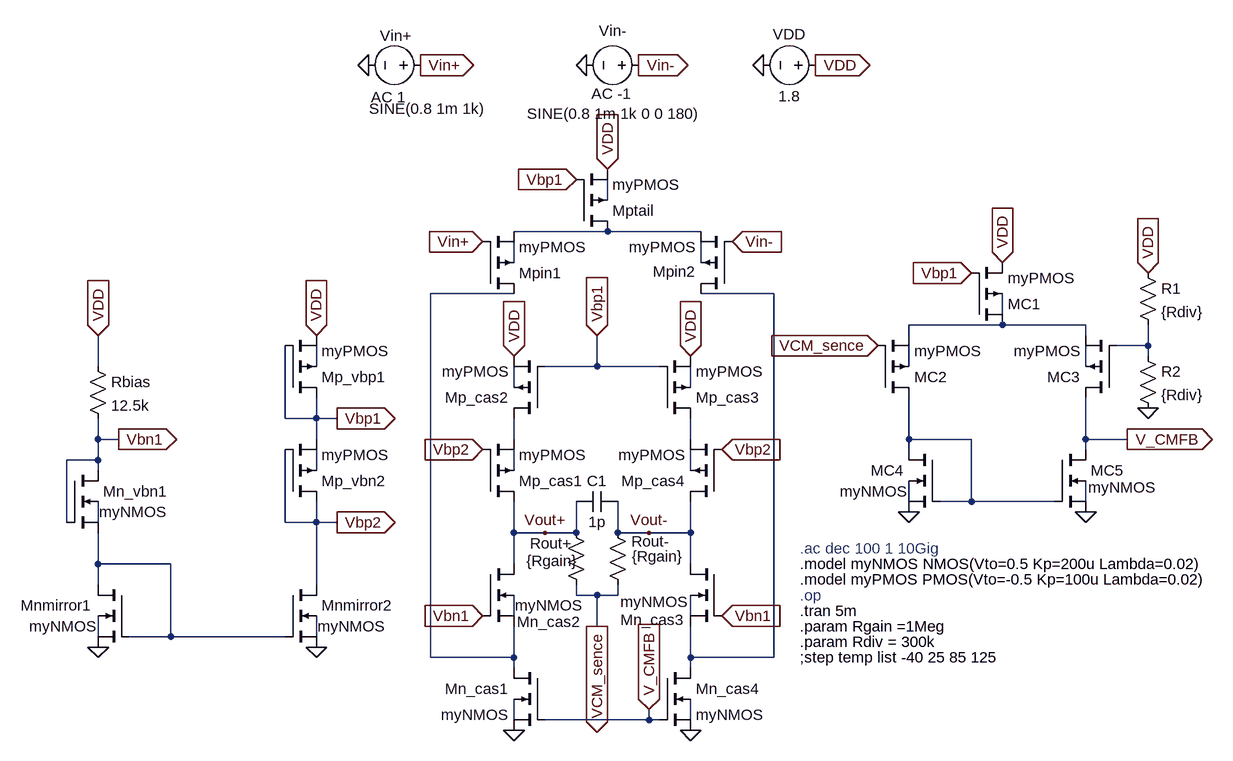
[diagram p0: schematic Fully_Differential_Folded_Cascode_OTA_with_CMFB.asc]
Fully_Differential_Folded_Cascode_OTA_with_CMFB.asc, the LTspice schematic file:
Version 4.1
SHEET 1 3100 840
WIRE 1792 -64 1792 -96
WIRE 1792 -16 1648 -16
WIRE 1936 -16 1792 -16
WIRE 1648 32 1648 0
WIRE 1936 32 1936 0
WIRE 1648 80 1520 80
WIRE 2048 80 1936 80
WIRE 2400 112 2400 80
WIRE 2400 128 2256 128
WIRE 2528 128 2400 128
WIRE 2256 144 2256 128
WIRE 2528 144 2528 128
WIRE 2624 160 2624 128
WIRE 2624 160 2576 160
WIRE 2624 176 2624 160
WIRE 1008 192 1008 144
WIRE 1344 192 1344 160
WIRE 1776 192 1776 144
WIRE 1776 192 1696 192
WIRE 1872 192 1776 192
WIRE 2256 192 2256 160
WIRE 2528 192 2528 160
WIRE 1648 224 1648 192
WIRE 1920 224 1920 192
WIRE 1296 272 1296 160
WIRE 1344 272 1344 240
WIRE 1344 272 1296 272
WIRE 1376 272 1344 272
WIRE 1008 304 1008 272
WIRE 1040 304 1008 304
WIRE 1344 304 1344 272
WIRE 1648 304 1648 272
WIRE 1920 304 1920 272
WIRE 2256 304 2256 240
WIRE 2352 304 2256 304
WIRE 2528 304 2528 240
WIRE 2592 304 2528 304
WIRE 2256 320 2256 304
WIRE 2528 320 2528 304
WIRE 1008 336 1008 304
WIRE 1008 336 960 336
WIRE 1008 352 1008 336
WIRE 1344 352 1344 320
WIRE 1648 352 1648 320
WIRE 1920 352 1920 320
WIRE 2256 400 2256 368
WIRE 2352 400 2352 304
WIRE 2352 400 2304 400
WIRE 2480 400 2352 400
WIRE 2528 400 2528 368
WIRE 960 432 960 336
WIRE 1008 432 1008 400
WIRE 1296 432 1296 320
WIRE 1344 432 1344 400
WIRE 1344 432 1296 432
WIRE 1376 432 1344 432
WIRE 1648 448 1648 400
WIRE 1696 448 1648 448
WIRE 1744 448 1744 400
WIRE 1744 448 1696 448
WIRE 1808 448 1808 400
WIRE 1856 448 1808 448
WIRE 1920 448 1920 400
WIRE 1920 448 1856 448
WIRE 1008 496 1008 448
WIRE 1120 496 1008 496
WIRE 1648 496 1648 448
WIRE 1920 496 1920 448
WIRE 1008 528 1008 496
WIRE 1344 528 1344 432
WIRE 1744 544 1744 528
WIRE 1776 544 1744 544
WIRE 1808 544 1808 528
WIRE 1808 544 1776 544
WIRE 1648 576 1648 544
WIRE 1920 576 1920 544
WIRE 1776 592 1776 544
WIRE 1008 608 1008 576
WIRE 1120 608 1120 496
WIRE 1120 608 1056 608
WIRE 1296 608 1120 608
WIRE 1344 608 1344 576
WIRE 1520 640 1520 80
WIRE 1648 640 1648 592
WIRE 1648 640 1520 640
WIRE 1920 640 1920 592
WIRE 2048 640 2048 80
WIRE 2048 640 1920 640
WIRE 1648 656 1648 640
WIRE 1920 656 1920 640
WIRE 1648 736 1648 704
WIRE 1856 736 1856 720
WIRE 1856 736 1696 736
WIRE 1872 736 1856 736
WIRE 1920 736 1920 704
FLAG 2032 -272 0
FLAG 2112 -272 VDD
IOPIN 2112 -272 Out
FLAG 1792 -112 VDD
IOPIN 1792 -112 In
FLAG 1376 272 Vbp1
IOPIN 1376 272 Out
FLAG 1744 -96 Vbp1
IOPIN 1744 -96 In
FLAG 1760 -272 0
FLAG 1424 -272 0
FLAG 1920 752 0
FLAG 1648 752 0
FLAG 1648 176 VDD
IOPIN 1648 176 In
FLAG 1920 176 VDD
IOPIN 1920 176 In
FLAG 1376 432 Vbp2
IOPIN 1376 432 Out
FLAG 1600 576 Vbn1
IOPIN 1600 576 In
FLAG 1968 576 Vbn1
IOPIN 1968 576 In
FLAG 1600 320 Vbp2
IOPIN 1600 320 In
FLAG 1968 320 Vbp2
IOPIN 1968 320 In
FLAG 1696 448 Vout+
FLAG 1856 448 Vout-
FLAG 1776 144 Vbp1
IOPIN 1776 144 In
FLAG 1856 720 V_CMFB
IOPIN 1856 720 In
FLAG 1776 592 VCM_sence
IOPIN 1776 592 Out
FLAG 2400 32 VDD
IOPIN 2400 32 In
FLAG 2352 48 Vbp1
IOPIN 2352 48 In
FLAG 2208 160 VCM_sence
IOPIN 2208 160 In
FLAG 2256 416 0
FLAG 2528 416 0
FLAG 2592 304 V_CMFB
IOPIN 2592 304 Out
FLAG 1008 144 VDD
IOPIN 1008 144 In
FLAG 1008 624 0
FLAG 1040 304 Vbn1
IOPIN 1040 304 Out
FLAG 1344 624 0
FLAG 1344 144 VDD
IOPIN 1344 144 In
FLAG 2624 48 VDD
IOPIN 2624 48 In
FLAG 2624 256 0
FLAG 1840 -272 Vin-
IOPIN 1840 -272 Out
FLAG 1600 0 Vin+
IOPIN 1600 0 In
FLAG 1504 -272 Vin+
IOPIN 1504 -272 Out
FLAG 1984 0 Vin-
IOPIN 1984 0 In
SYMBOL voltage 2128 -272 R90
WINDOW 0 -32 56 VBottom 2
WINDOW 3 32 56 VTop 2
SYMATTR InstName VDD
SYMATTR Value 1.8
SYMBOL pmos4 1744 -16 M180
SYMATTR InstName Mptail
SYMATTR Value myPMOS
SYMATTR Value2 l=1u w=16u
SYMBOL pmos4 1600 80 M180
SYMATTR InstName Mpin1
SYMATTR Value myPMOS
SYMATTR Value2 l=1u w=8u
SYMBOL pmos4 1984 80 R180
WINDOW 0 56 34 Left 2
SYMATTR InstName Mpin2
SYMATTR Value myPMOS
SYMATTR Value2 l=1u w=8u
SYMBOL voltage 1856 -272 R90
WINDOW 0 -37 56 VBottom 2
WINDOW 3 59 55 VTop 2
WINDOW 123 60 58 VBottom 2
WINDOW 39 0 0 Left 0
SYMATTR InstName Vin-
SYMATTR Value SINE(0.8 1m 1k 0 0 180)
SYMATTR Value2 AC -1
SYMBOL voltage 1520 -272 R90
WINDOW 0 -61 54 VTop 2
WINDOW 3 83 6 VBottom 2
WINDOW 123 34 65 VTop 2
WINDOW 39 0 0 Left 0
SYMATTR InstName Vin+
SYMATTR Value SINE(0.8 1m 1k)
SYMATTR Value2 AC 1
SYMBOL pmos4 1696 272 R180
SYMATTR InstName Mp_cas2
SYMATTR Value myPMOS
SYMATTR Value2 l=1u w=8u
SYMBOL pmos4 1872 272 M180
SYMATTR InstName Mp_cas3
SYMATTR Value myPMOS
SYMATTR Value2 l=1u w=8u
SYMBOL pmos4 1600 400 M180
SYMATTR InstName Mp_cas1
SYMATTR Value myPMOS
SYMATTR Value2 l=1u w=8u
SYMBOL pmos4 1968 400 R180
SYMATTR InstName Mp_cas4
SYMATTR Value myPMOS
SYMATTR Value2 l=1u w=8u
SYMBOL nmos4 1600 496 R0
WINDOW 3 50 64 Left 2
WINDOW 0 53 89 Left 2
SYMATTR Value myNMOS
SYMATTR InstName Mn_cas2
SYMATTR Value2 l=1u w=4u
SYMBOL nmos4 1696 656 M0
SYMATTR InstName Mn_cas1
SYMATTR Value myNMOS
SYMATTR Value2 l=1u w=8u
SYMBOL nmos4 1968 496 M0
WINDOW 3 52 58 Left 2
WINDOW 0 58 86 Left 2
SYMATTR Value myNMOS
SYMATTR InstName Mn_cas3
SYMATTR Value2 l=1u w=4u
SYMBOL nmos4 1872 656 R0
SYMATTR InstName Mn_cas4
SYMATTR Value myNMOS
SYMATTR Value2 l=1u w=8u
SYMBOL res 1728 432 R0
WINDOW 0 -55 32 Left 2
WINDOW 3 -61 59 Left 2
SYMATTR InstName Rout+
SYMATTR Value {Rgain}
SYMBOL res 1792 432 R0
WINDOW 0 37 29 Left 2
WINDOW 3 38 52 Left 2
SYMATTR InstName Rout-
SYMATTR Value {Rgain}
SYMBOL pmos4 2352 128 M180
SYMATTR InstName MC1
SYMATTR Value myPMOS
SYMATTR Value2 l=1u w=16u
SYMBOL pmos4 2208 240 M180
SYMATTR InstName MC2
SYMATTR Value myPMOS
SYMATTR Value2 l=1u w=8u
SYMBOL pmos4 2576 240 R180
SYMATTR InstName MC3
SYMATTR Value myPMOS
SYMATTR Value2 l=1u w=8u
SYMBOL nmos4 2304 320 M0
WINDOW 3 50 64 Left 2
SYMATTR Value myNMOS
SYMATTR InstName MC4
SYMATTR Value2 l=1u w=4u
SYMBOL nmos4 2480 320 R0
WINDOW 3 52 58 Left 2
SYMATTR Value myNMOS
SYMATTR InstName MC5
SYMATTR Value2 l=1u w=4u
SYMBOL res 992 176 R0
SYMATTR InstName Rbias
SYMATTR Value 12.5k
SYMBOL nmos4 960 352 R0
WINDOW 3 50 64 Left 2
SYMATTR Value myNMOS
SYMATTR InstName Mn_vbn1
SYMATTR Value2 l=1u w=8u
SYMBOL nmos4 1056 528 M0
WINDOW 3 50 64 Left 2
SYMATTR Value myNMOS
SYMATTR InstName Mnmirror1
SYMATTR Value2 l=1u w=8u
SYMBOL nmos4 1296 528 R0
WINDOW 3 50 64 Left 2
SYMATTR Value myNMOS
SYMATTR InstName Mnmirror2
SYMATTR Value2 l=1u w=8u
SYMBOL pmos4 1296 400 M180
SYMATTR InstName Mp_vbn2
SYMATTR Value myPMOS
SYMATTR Value2 l=1u w=16u
SYMBOL pmos4 1296 240 M180
SYMATTR InstName Mp_vbp1
SYMATTR Value myPMOS
SYMATTR Value2 l=1u w=16u
SYMBOL res 2608 32 R0
SYMATTR InstName R1
SYMATTR Value {Rdiv}
SYMBOL res 2608 160 R0
SYMATTR InstName R2
SYMATTR Value {Rdiv}
SYMBOL cap 1808 384 R90
WINDOW 0 0 32 VBottom 2
WINDOW 3 32 32 VTop 2
SYMATTR InstName C1
SYMATTR Value 1p
TEXT 2088 496 Left 2 !.model myNMOS NMOS(Vto=0.5 Kp=200u Lambda=0.02)
TEXT 2088 520 Left 2 !.model myPMOS PMOS(Vto=-0.5 Kp=100u Lambda=0.02)
TEXT 2088 544 Left 2 ;.op
TEXT 2088 568 Left 2 !.tran 5m
TEXT 2088 472 Left 2 ;.ac dec 100 1 10Gig
TEXT 2088 592 Left 2 !.param Rgain =1Meg
TEXT 2088 616 Left 2 !.param Rdiv = 300k
TEXT 2088 640 Left 2 !;step temp list -40 25 85 125

The netlist it stands for:
* Fully_Differential_Folded_Cascode_OTA_with_CMFB.asc
VDD VDD 0 1.8
Mptail N002 Vbp1 VDD N001 myPMOS l=1u w=16u
Mpin1 N005 Vin+ N002 N003 myPMOS l=1u w=8u
Mpin2 N006 Vin- N002 N004 myPMOS l=1u w=8u
Vin- Vin- 0 SINE(0.8 1m 1k 0 0 180) AC -1
Vin+ Vin+ 0 SINE(0.8 1m 1k) AC 1
Mp_cas2 N015 Vbp1 VDD N013 myPMOS l=1u w=8u
Mp_cas3 N016 Vbp1 VDD N014 myPMOS l=1u w=8u
Mp_cas1 Vout+ Vbp2 N015 N019 myPMOS l=1u w=8u
Mp_cas4 Vout- Vbp2 N016 N020 myPMOS l=1u w=8u
Mn_cas2 Vout+ Vbn1 N005 N025 myNMOS l=1u w=4u
Mn_cas1 N005 V_CMFB 0 N029 myNMOS l=1u w=8u
Mn_cas3 Vout- Vbn1 N006 N026 myNMOS l=1u w=4u
Mn_cas4 N006 V_CMFB 0 N030 myNMOS l=1u w=8u
Rout+ Vout+ VCM_sence {Rgain}
Rout- Vout- VCM_sence {Rgain}
MC1 N008 Vbp1 VDD N007 myPMOS l=1u w=16u
MC2 N017 VCM_sence N008 N011 myPMOS l=1u w=8u
MC3 V_CMFB N009 N008 N012 myPMOS l=1u w=8u
MC4 N017 N017 0 N021 myNMOS l=1u w=4u
MC5 V_CMFB N017 0 N022 myNMOS l=1u w=4u
Rbias VDD Vbn1 12.5k
Mn_vbn1 Vbn1 Vbn1 N024 N023 myNMOS l=1u w=8u
Mnmirror1 N024 N024 0 N027 myNMOS l=1u w=8u
Mnmirror2 Vbp2 N024 0 N028 myNMOS l=1u w=8u
Mp_vbn2 Vbp2 Vbp2 Vbp1 N018 myPMOS l=1u w=16u
Mp_vbp1 Vbp1 Vbp1 VDD N010 myPMOS l=1u w=16u
R1 VDD N009 {Rdiv}
R2 N009 0 {Rdiv}
C1 Vout- Vout+ 1p
.model NMOS NMOS
.model PMOS PMOS
.lib standard.mos
.model myNMOS NMOS(Vto=0.5 Kp=200u Lambda=0.02)
.model myPMOS PMOS(Vto=-0.5 Kp=100u Lambda=0.02)
* .op
.tran 5m
* .ac dec 100 1 10Gig
.param Rgain =1Meg
.param Rdiv = 300k
;step temp list -40 25 85 125
.backanno
.end